# EAGLE design DAU_Kupplung_1_phasig_V1_13 (EAGLE 6.1)
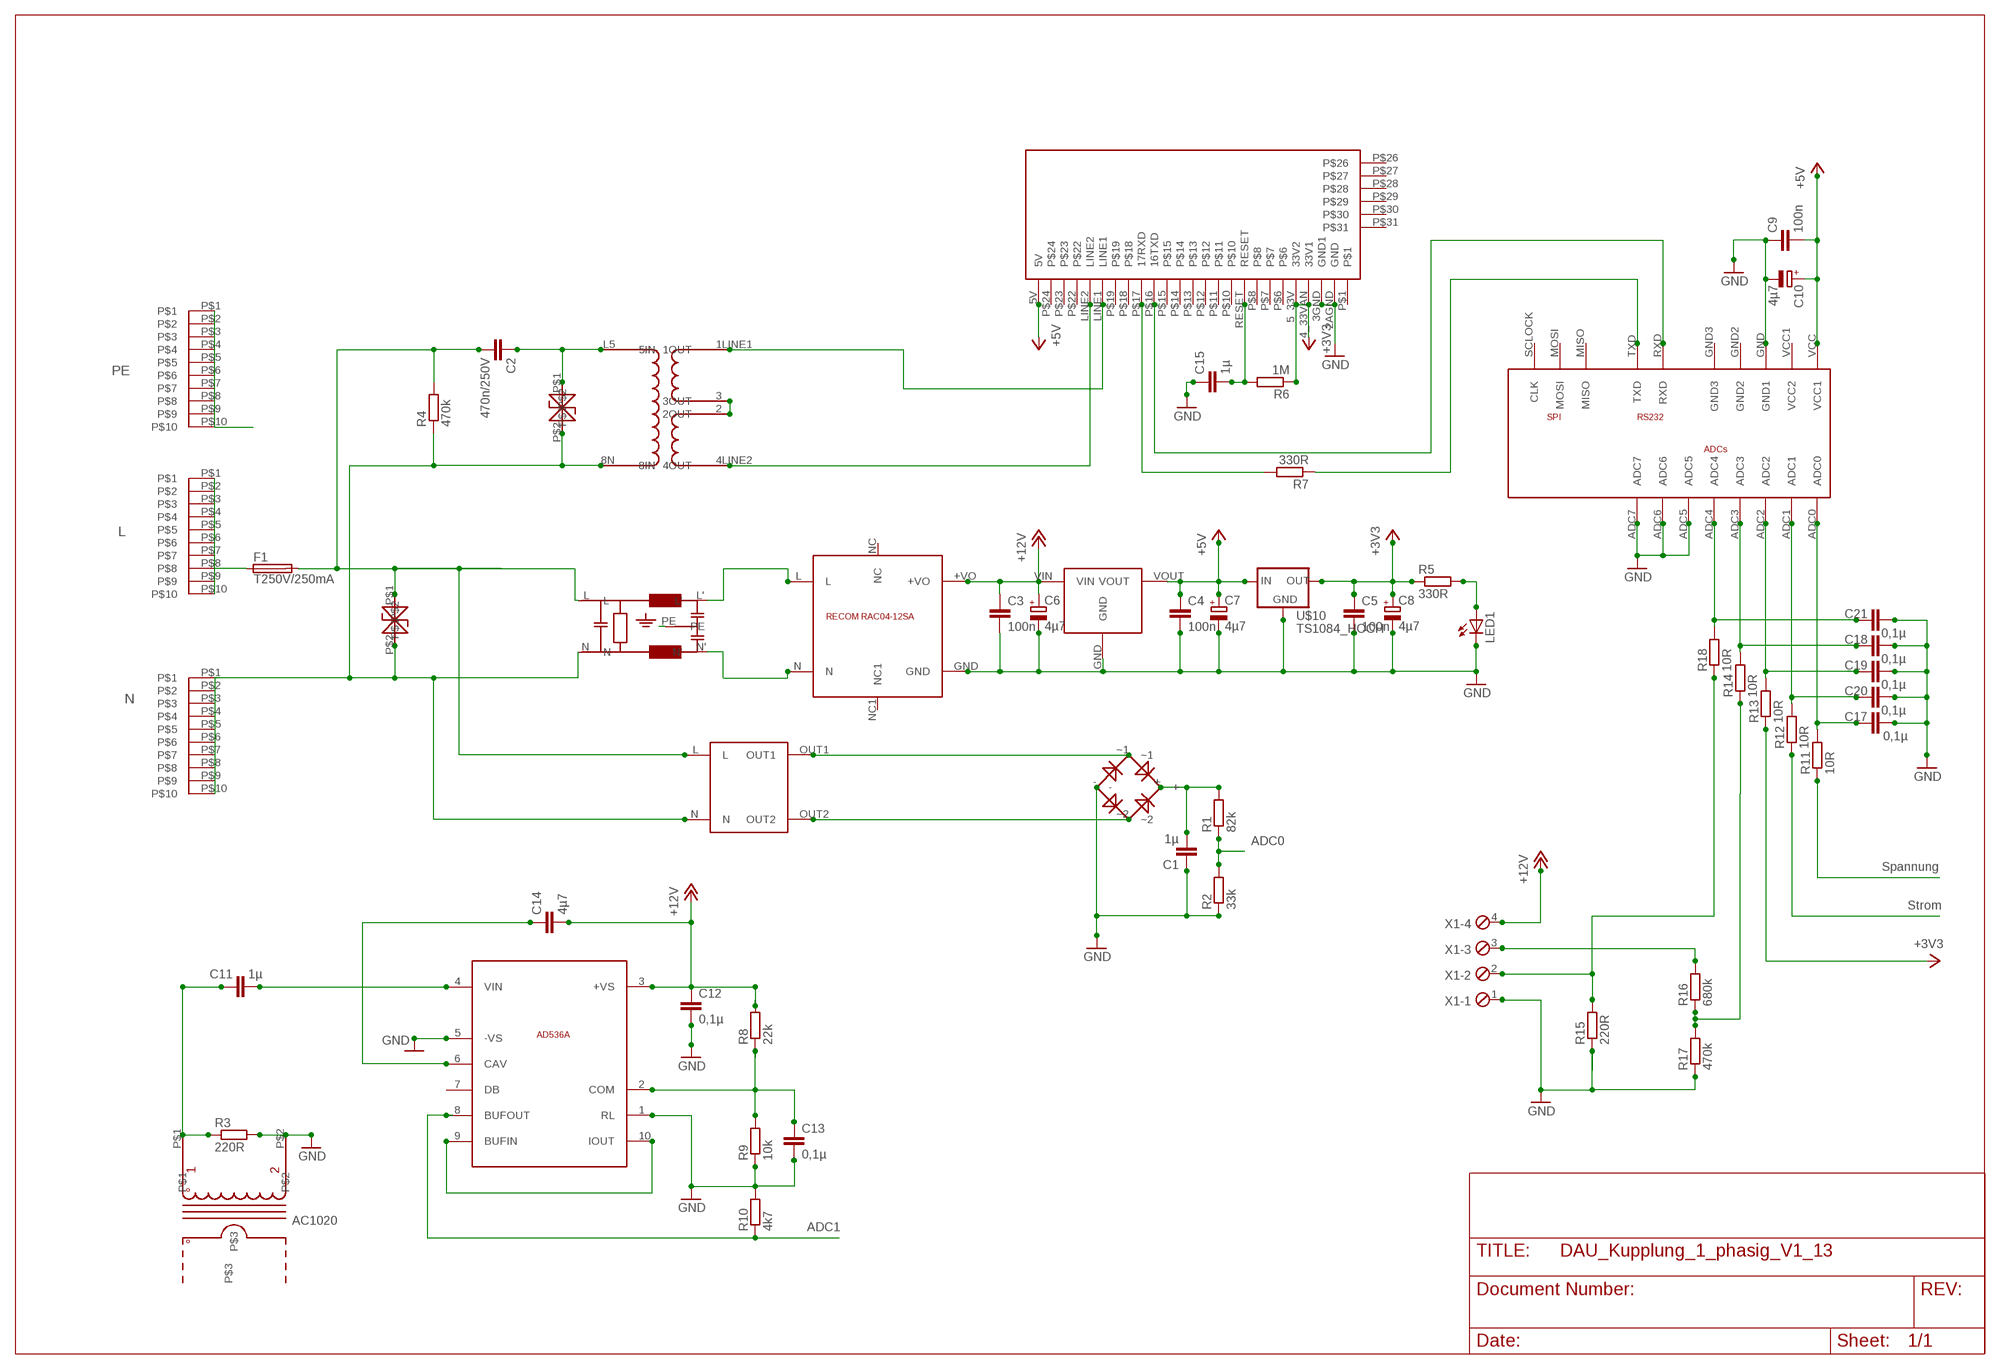
[diagram p0: schematic, sheet 1]

## Parts
AC1020  AC1010  [AC1010]
C1  1µ  C2,5-3  [C2.5-3]
C2  470n/250V  C-EU150-072X183  [C150-072X183]
C3  100n  C-EUC0805  [C0805]
C4  100n  C-EUC0805  [C0805]
C5  100n  C-EUC0805  [C0805]
C6  4µ7  CPOL-EUE2-4  [E2-4]
C7  4µ7  CPOL-EUE2-4  [E2-4]
C8  4µ7  CPOL-EUE2-4  [E2-4]
C9  100n  C-EUC0805  [C0805]
C10  4µ7  CPOL-EUE2-4  [E2-4]
C11  1µ  C-EUC0805  [C0805]
C12  0,1µ  C-EUC0805  [C0805]
C13  0,1µ  C-EUC0805  [C0805]
C14  4µ7  C-EUC0805  [C0805]
C15  1µ  C-EUC0805  [C0805]
C17  0,1µ  C-EUC0805  [C0805]
C18  0,1µ  C-EUC0805  [C0805]
C19  0,1µ  C-EUC0805  [C0805]
C20  0,1µ  C-EUC0805  [C0805]
C21  0,1µ  C-EUC0805  [C0805]
F1  T250V/250mA  TR5  [TR5]
L  PRINT_CONNECTOR  [FASTON_DOUBLE]
LED1  LEDSQR2X5  [LED2X5]
N  PRINT_CONNECTOR  [FASTON_DOUBLE]
PE  PRINT_CONNECTOR  [FASTON_DOUBLE]
R1  82k  R-EU_R1206  [R1206]
R2  33k  R-EU_R1206  [R1206]
R3  220R  R-EU_R1206  [R1206]
R4  470k  R-EU_0204/7  [0204/7]
R5  330R  R-EU_R1206  [R1206]
R6  1M  R-EU_R1206  [R1206]
R7  330R  R-EU_R1206  [R1206]
R8  22k  R-EU_R1206  [R1206]
R9  10k  R-EU_R1206  [R1206]
R10  4k7  R-EU_R1206  [R1206]
R11  10R  R-EU_R1206  [R1206]
R12  10R  R-EU_R1206  [R1206]
R13  10R  R-EU_R1206  [R1206]
R14  10R  R-EU_R1206  [R1206]
R15  220R  R-EU_R1206  [R1206]
R16  680k  R-EU_R1206  [R1206]
R17  470k  R-EU_R1206  [R1206]
R18  10R  R-EU_R1206  [R1206]
U$1  RECOM_RAC04_12SA  [RAC04_12SA]
U$2  SICHERHEITSTRAFO  [TRAFO_0,35VA]
U$3  ADUC831_MINIMUM  [ADUC_MINIMUM]
U$4  IT800  [IT800]
U$5  PLC_UEBERTRAGER_V2  [PLC-UEBERTRAGER_V2]
U$6  NETZFILTER_05_A  [NETZFILTER]
U$7  AD536  [TO100_10PIN]
U$8  RECTIFIER  [RECTIFIER]
U$9  TSV  [TSV]
U$10  TS1084_HOCH  [TS1084_HOCH]
U$11  RECOM_785_05  [RECOM785X]
U$12  TSV  [TSV]
X1  MPT4  [4POL254]

## Nets
+3V3: C5.1 C8.+ R5.1 R6.1 R13.1 U$4.4_33VAN(33V1) U$4.5_33V(33V2) U$10.OUT
+5V: C4.1 C7.+ C9.2 C10.+ U$3.VCC(VCC1) U$4.5V U$10.IN U$11.VOUT
+12V: C3.1 C6.+ C12.1 C14.2 R8.2 U$1.+VO U$7.3(+VS) U$11.VIN X1.4
ADC0: R1.1 R2.2 R11.1
ADC1: R10.1 R12.1 U$7.8(BUFOUT)
GND: AC1020.P$2 C1.1 C3.2 C4.2 C5.2 C6.- C7.- C8.- C9.1 C10.- C12.2 C13.2 C15.1 C17.2 C18.2 C19.2 C20.2 C21.2 LED1.K(C) R2.1 R3.2 R9.1 R10.2 R15.1 R17.1 U$1.GND U$3.ADC5 U$3.ADC6 U$3.ADC7 U$3.GND(GND1) U$4.2AGND(GND) U$4.3GND(GND1) U$7.1(RL) U$7.5(-VS) U$8.- U$10.GND U$11.GND X1.1
N$1: U$5.2(2OUT) U$5.3(3OUT)
N$2: U$7.9(BUFIN) U$7.10(IOUT)
N$3: R7.2 U$4.P$17(17RXD)
N$4: U$2.OUT1 U$8.~1
N$5: U$4.LINE1 U$5.1LINE1(1OUT)
N$6: F1.1 L.P$1 L.P$2 L.P$3 L.P$4 L.P$5 L.P$6 L.P$7 L.P$8 L.P$9 L.P$10
N$7: C1.2 R1.2 U$8.+
N$8: AC1020.P$1 C11.1 R3.1
N$9: U$2.OUT2 U$8.~2
N$10: C11.2 U$7.4(VIN)
N$11: C2.1 U$5.L5(5IN) U$12.P$1
N$13: U$4.LINE2 U$5.4LINE2(4OUT)
N$14: R7.1 U$3.TXD
N$15: U$3.RXD U$4.P$16(16TXD)
N$16: C14.1 U$7.6(CAV)
N$17: C21.1 R18.2 U$3.ADC4
N$18: U$1.L U$6.L'
N$19: LED1.A R5.2
N$20: C15.2 R6.2 U$4.RESET
N$21: C13.1 R8.1 R9.2 U$7.2(COM)
N$22: U$1.N U$6.N'
N$23: N.P$1 N.P$2 N.P$3 N.P$4 N.P$5 N.P$6 N.P$7 N.P$8 N.P$9 N.P$10 R4.1 U$2.N U$5.8N(8IN) U$6.N U$9.P$2 U$12.P$2
N$24: C2.2 F1.2 R4.2 U$2.L U$6.L U$9.P$1
N$27: C18.1 R14.2 U$3.ADC3
N$28: C19.1 R13.2 U$3.ADC2
N$29: C20.1 R12.2 U$3.ADC1
N$30: C17.1 R11.2 U$3.ADC0
N$31: R15.2 R18.1 X1.2
N$32: R16.2 X1.3
N$33: R14.1 R16.1 R17.2
PE: PE.P$1 PE.P$2 PE.P$3 PE.P$4 PE.P$5 PE.P$6 PE.P$7 PE.P$8 PE.P$9 PE.P$10 U$6.PE
Unconnected: AC1020.P$3 U$1.NC U$1.NC1 U$3.GND2 U$3.GND3 U$3.MISO U$3.MOSI U$3.SCLOCK(CLK) U$3.VCC1(VCC2) U$4.P$1 U$4.P$6 U$4.P$7 U$4.P$8 U$4.P$10 U$4.P$11 U$4.P$12 U$4.P$13 U$4.P$14 U$4.P$15 U$4.P$18 U$4.P$19 U$4.P$22 U$4.P$23 U$4.P$24 U$4.P$26 U$4.P$27 U$4.P$28 U$4.P$29 U$4.P$30 U$4.P$31 U$7.7(DB)

## Notes on the sheet
- PE
- L
- N
- ADC0
- Spannung
- Strom
- AC1020
- ADC1

## Library data of the parts
AC1020 = ADS:AC1010
C1 = capacitor-wima:C: CAPACITOR naming: grid - package width
C2-C5 C15 C17-C21 = resistor:C-EU: CAPACITOR, European symbol
C6-C8 C10 = rcl:CPOL-EU: POLARIZED CAPACITOR, European symbol
C9 C11-C14 = rcl:C-EU: CAPACITOR, European symbol
F1 = fuse:TR5: FUSE Wickmann; OC_FARNELL: unknown; OC_NEWARK: unknown
L N PE = ADS:PRINT_CONNECTOR
LED1 = led:LED: LED OSRAM: - CHIPLED LG R971, LG N971, LY N971, LG Q971, LY Q971, LO R971, LY R971 LH N974, LH R974 LS Q976, LO Q976, LY Q976 LO Q996 - Hyper CHIPLED LW Q18S LB Q993, LB Q99A, LB R99A - SideLED LS A670, LO A670, LY A670, LG A670, LP A670 LB A673, LV A673, LT A673, LW A673 LH A674 LY A675 LS A676, LA A676, LO A676, LY A676, LW A676 LS A679, LY A679, LG A679 - Hyper Micro SIDELED® LS Y876, LA Y876, LO Y876, LY Y876 LT Y87S - SmartLED LW L88C, LW L88S LB L89C, LB L89S, LG L890 LS L89K, LO L89K, LY L89K LS L896, LA L896, LO L896, LY L896 - TOPLED LS T670, LO T670, LY T670, LG T670, LP T670 LSG T670, LSP T670, LSY T670, LOP T670, LYG T670 LG T671, LOG T671, LSG T671 LB T673, LV T673, LT T673, LW T673 LH T674 LS T676, LA T676, LO T676, LY T676, LB T676, LH T676, LSB T676, LW T676 LB T67C, LV T67C, LT T67C, LS T67K, LO T67K, LY T67K, LW E67C LS E67B, LA E67B, LO E67B, LY E67B, LB E67C, LV E67C, LT E67C LW T67C LS T679, LY T679, LG T679 LS T770, LO T770, LY T770, LG T770, LP T770 LB T773, LV T773, LT T773, LW T773 LH T774 LS E675, LA E675, LY E675, LS T675 LS T776, LA T776, LO T776, LY T776, LB T776 LHGB T686 LT T68C, LB T68C - Hyper Mini TOPLED® LB M676 - Mini TOPLED Santana® LG M470 LS M47K, LO M47K, LY M47K Source: http://www.osram.convergy.de LUXEON: - LUMILED® LXK2-PW12-R00, LXK2-PW12-S00, LXK2-PW14-U00, LXK2-PW14-V00 LXK2-PM12-R00, LXK2-PM12-S00, LXK2-PM14-U00 LXK2-PE12-Q00, LXK2-PE12-R00, LXK2-PE12-S00, LXK2-PE14-T00, LXK2-PE14-U00 LXK2-PB12-K00, LXK2-PB12-L00, LXK2-PB12-M00, LXK2-PB14-N00, LXK2-PB14-P00, LXK2-PB14-Q00 LXK2-PR12-L00, LXK2-PR12-M00, LXK2-PR14-Q00, LXK2-PR14-R00 LXK2-PD12-Q00, LXK2-PD12-R00, LXK2-PD12-S00 LXK2-PH12-R00, LXK2-PH12-S00 LXK2-PL12-P00, LXK2-PL12-Q00, LXK2-PL12-R00 Source: www.luxeon.com KINGBRIGHT: KA-3528ASYC Source: www.kingbright.com
R1-R18 = resistor:R-EU_: RESISTOR, European symbol
U$1 = ADS:RECOM_RAC04_12SA
U$2 = ADS:SICHERHEITSTRAFO
U$3 = ADS_ADUCBoards:ADUC831_MINIMUM
U$4 = ADS:IT800
U$5 = ADS1:PLC_UEBERTRAGER_V2
U$6 = ADS:NETZFILTER_05_A
U$7 = ADS:AD536
U$8 = ADS:RECTIFIER
U$9 U$12 = ADS:TSV
U$10 = ADS:TS1084_HOCH
U$11 = ADS:RECOM_785_05
X1 = con-phoenix-254:MPT4: PHOENIX CONNECTOR; OC_FARNELL: unknown; OC_NEWARK: unknown

## Board
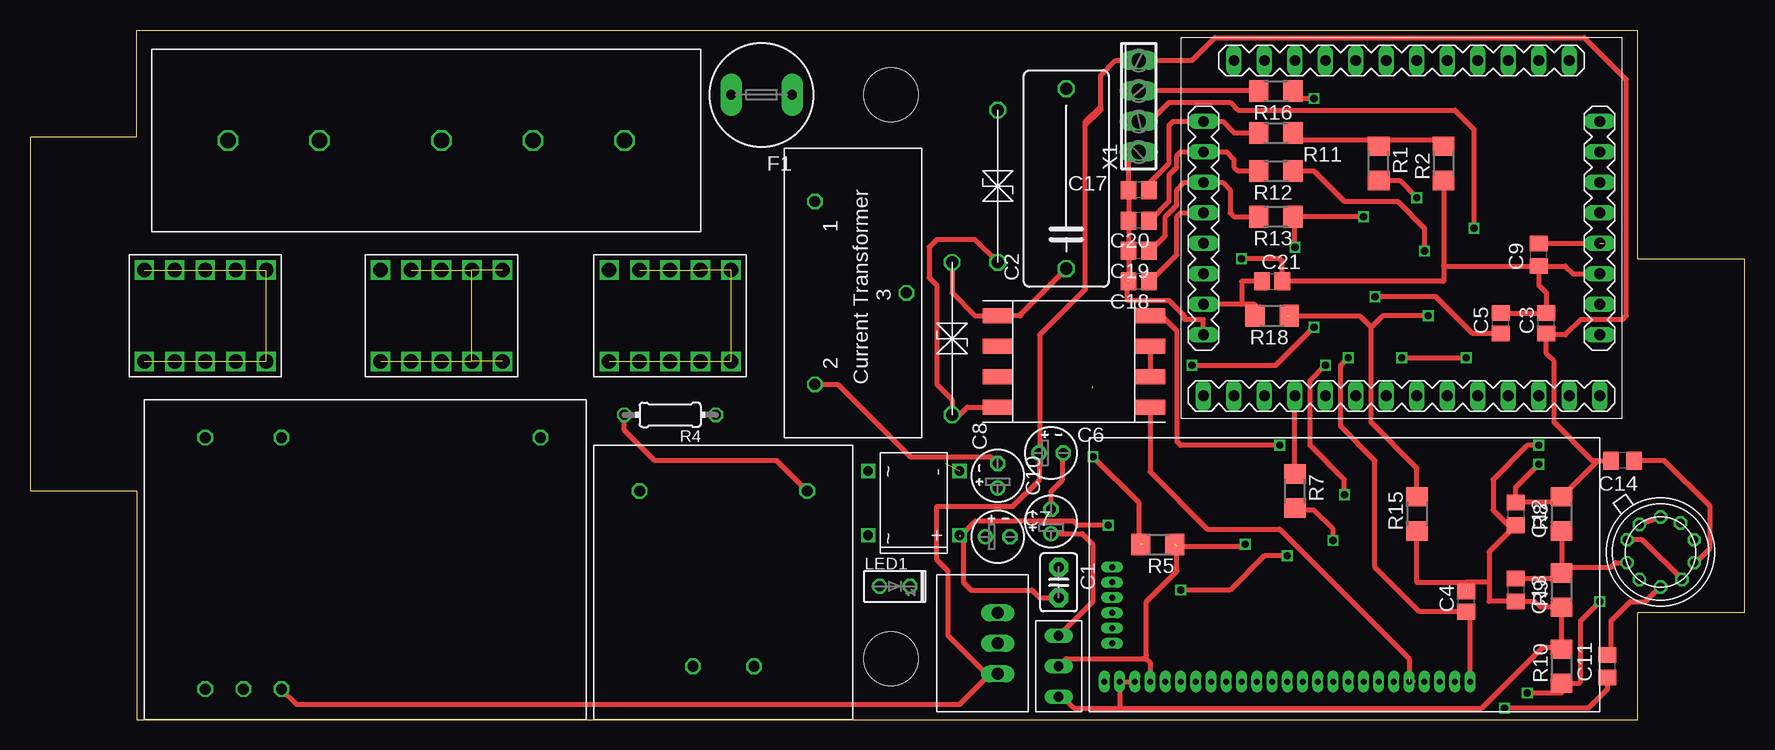
[diagram p1: board, top side]
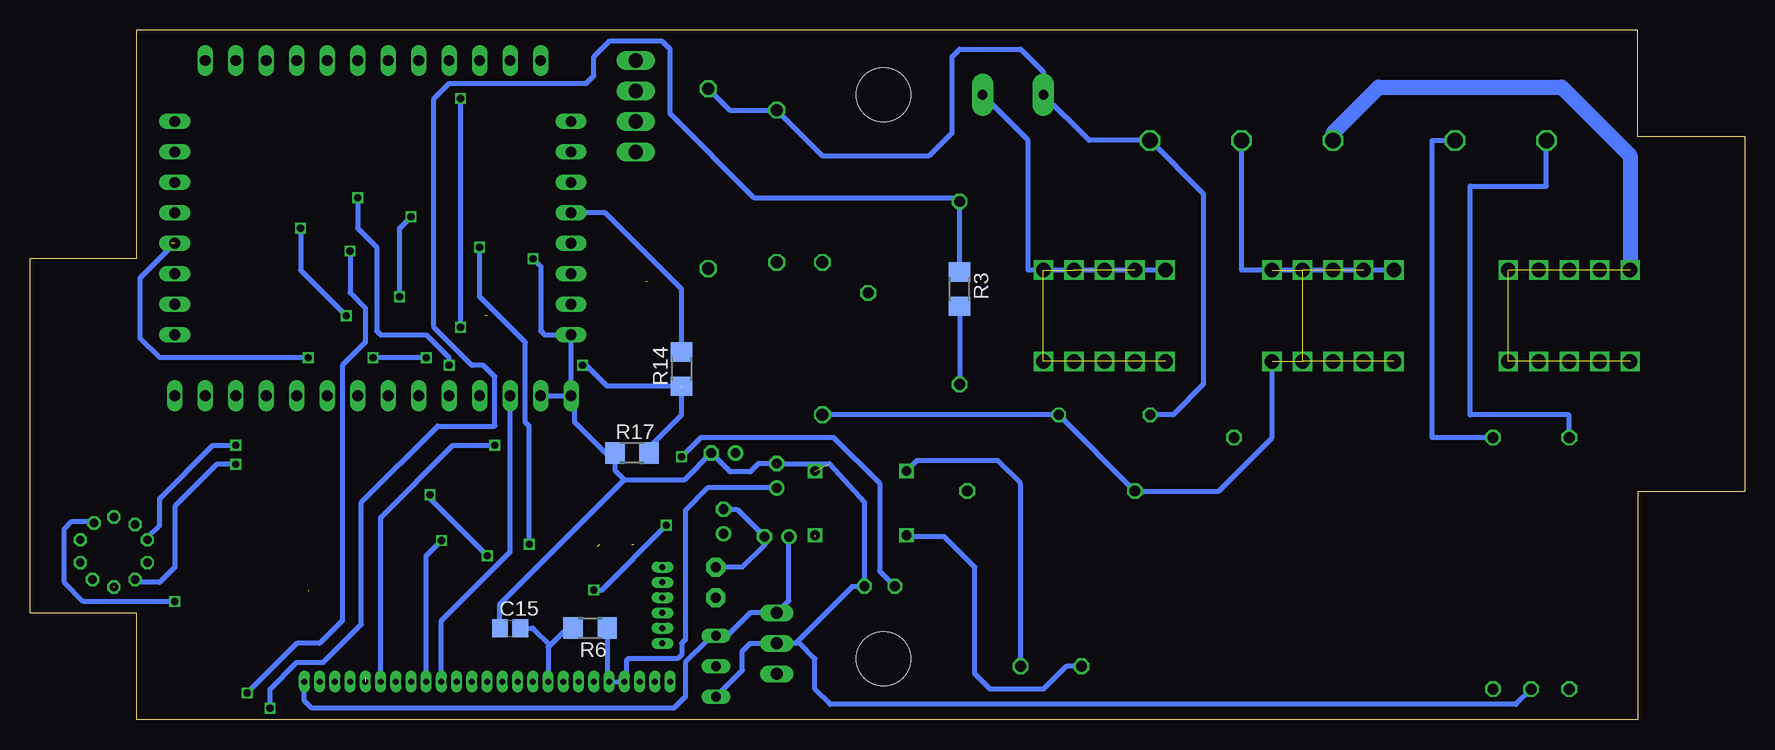
[diagram p2: board, bottom side, seen from below]

Size 142.88 x 57.47 mm. Coordinates in mm from the lower left corner, seen from the top.
Outline: 8.89,0 133.99,0 133.99,8.89 142.88,8.89 142.88,38.42 133.99,38.42 133.99,57.47 8.89,57.47 8.89,48.58 0,48.58 0,19.05 8.89,19.05 8.89,0
Copper layers (1+2*15+16): Top 0.035mm / dielectric 0.38mm / Route2 0.035mm / dielectric 0.71mm / Route15 0.035mm / dielectric 0.38mm / Bottom 0.035mm
Design rules: minimum track width 0.15mm, minimum drill 0.3mm, track to track 0.15mm, track to pad 0.15mm, pad to pad 0.15mm, via to via 0.15mm, smd to smd 0.15mm, copper to edge 0.3mm, drill to drill 0.2mm, minimum pad ring 0.2mm, minimum via ring 0.15mm, stop-mask expansion 0.075mm, vias tented up to drill 0mil, thermal gap 0.2mm
Holes 4.5 mm at 71.75,52.07 71.75,5.08

### Footprints (pad centres in the part's own frame; a part is rotated, then mirrored left to right if it is on the bottom)
AC1010 = drill 0.9 octagon: P$1 20.32,8.89; P$2 5.08,8.89; P$3 12.7,1.27
C2.5-3 = drill 0.813 pad 1.6 octagon: 1 -1.27,0; 2 1.27,0
C150-072X183 = drill 1.016 octagon: 1 -7.493,0; 2 7.493,0
C0805 = smd 1.3 x 1.5: 1 -0.85,0; 2 0.85,0
E2-4 = drill 0.813 pad 1.27: + -1.016,0 | drill 0.813 pad 1.27 octagon: - 1.016,0
C0805' = smd 1.3 x 1.5: 1 -0.95,0; 2 0.95,0
TR5 = drill 0.813 pad 1.778 long: 1 -2.54,0; 2 2.54,0
FASTON_DOUBLE = drill 1.2 square: P$1 -5.08,-3.81; P$2 -2.54,-3.81; P$3 -5.08,3.81; P$4 -2.54,3.81; P$5 0,3.81; P$6 2.54,3.81; P$7 5.08,3.81; P$8 0,-3.81; P$9 2.54,-3.81; P$10 5.08,-3.81
LED2X5 = drill 0.813 octagon: A -1.27,0; K 1.27,0
R1206 = smd 1.6 x 1.803: 1 -1.422,0; 2 1.422,0
0204/7 = drill 0.813 octagon: 1 -3.81,0; 2 3.81,0
RAC04_12SA = drill 0.9 octagon: +VO 25.4,24.13; GND 28.575,24.13; L 31.75,3.175; N 25.4,3.175; NC 3.81,3.175; NC1 31.75,24.13
TRAFO_0,35VA = drill 0.9 octagon: L 3.81,17.78; N 3.81,3.81; OUT1 18.415,13.335; OUT2 18.415,8.255
ADUC_MINIMUM = drill 0.9 long: ADC0 -9.207,-16.51; ADC1 -6.668,-16.51; ADC2 -4.128,-16.51; ADC3 -1.587,-16.51; ADC4 6.032,-16.51; ADC5 8.572,-16.51; ADC6 13.652,-16.51; ADC7 13.652,-13.97; ALE -14.287,6.35; DAC0 0.953,-16.51; DAC1 3.493,-16.51; GND 3.493,16.51; GND2 -4.128,16.51; GND3 -6.668,16.51; INT0 13.652,-6.35; MISO 13.652,-3.81; MOSI 13.652,11.43; P00 -14.287,3.81; P01 -14.287,1.27; P02 -14.287,-1.27; P03 -14.287,-3.81; P04 -14.287,-6.35; P05 -14.287,-8.89; P06 -14.287,-11.43; P07 -14.287,-13.97; P20 13.652,13.97; P21 13.652,16.51; P22 8.572,16.51; P23 6.032,16.51; P24 -9.207,16.51; P25 -14.287,13.97; P34 13.652,-1.27; P35 13.652,1.27; P36 13.652,3.81; P37 13.652,6.35; PWM0 -14.287,11.43; PWM1 -14.287,8.89; RXD 13.652,-11.43; SCLOCK 13.652,8.89; TXD 13.652,-8.89; VCC 0.953,16.51; VCC1 -1.587,16.51
IT800 = drill 0.5 long: 2AGND 2.54,2.54; 3GND 3.81,2.54; 4_33VAN 5.08,2.54; 5_33V 6.35,2.54; 5V 31.75,2.54; LINE1 25.4,2.54; LINE2 26.67,2.54; P$1 1.27,2.54; P$6 7.62,2.54; P$7 8.89,2.54; P$8 10.16,2.54; P$10 12.7,2.54; P$11 13.97,2.54; P$12 15.24,2.54; P$13 16.51,2.54; P$14 17.78,2.54; P$15 19.05,2.54; P$16 20.32,2.54; P$17 21.59,2.54; P$18 22.86,2.54; P$19 24.13,2.54; P$22 27.94,2.54; P$23 29.21,2.54; P$24 30.48,2.54; P$26 1.905,5.715; P$27 1.905,6.985; P$28 1.905,8.255; P$29 1.905,9.525; P$30 1.905,10.795; P$31 1.905,12.065; RESET 11.43,2.54
PLC-UEBERTRAGER_V2 = smd 2.54 x 1.27: 1LINE1 6.35,3.81; 2 6.35,1.27; 3 6.35,-1.27; 4LINE2 6.35,-3.81; 6NC -6.35,1.27; 7NC -6.35,-1.27; 8N -6.35,-3.81; L5 -6.35,3.81
NETZFILTER = drill 1.3 octagon: L 6.35,7.62; L' 39.37,7.62; N 13.97,7.62; N' 31.75,7.62; PE 21.59,7.62
TO100_10PIN = drill 0.7 octagon: 1 2.794,-1.016; 2 2.794,0.889; 3 1.778,2.286; 4 0,2.921; 5 -1.778,2.286; 6 -2.794,0.889; 7 -2.794,-1.016; 8 -1.651,-2.413; 9 0,-2.921; 10 1.778,-2.286
RECTIFIER = drill 0.8 square: + 6.858,7.62; - 1.524,7.62; ~1 1.524,0; ~2 6.858,0
TSV = drill 1 octagon: P$1 -5.08,0; P$2 7.62,0
TS1084_HOCH = drill 0.8 long: GND 0,0; IN 5.08,0; OUT 2.54,0
RECOM785X = drill 1 long: GND 0,2.54; VIN -2.54,2.54; VOUT 2.54,2.54
4POL254 = drill 1.2 long: 1 -3.81,0; 2 -1.27,0; 3 1.27,0; 4 3.81,0

### Placement (x,y rotation side)
AC1020  74.3,22.86 90 top
C1  85.72,11.43 270 top
C2  86.36,45.09 90 top
C3  126.36,33.02 90 top
C4  119.7,9.84 90 top
C5  122.56,33.02 90 top
C6  85.09,22.23 0 top
C7  80.64,15.24 0 top
C8  80.64,20.32 90 top
C9  100n  [C0805']  125.73,38.73 90 top
C10  85.09,16.51 90 top
C11  1µ  [C0805']  131.44,4.45 90 top
C12  0,1µ  [C0805']  123.83,17.14 270 top
C13  0,1µ  [C0805']  123.83,10.79 270 top
C14  4µ7  [C0805']  132.72,21.59 180 top
C15  102.87,7.62 0 bottom
C17  92.39,44.13 180 top
C18  92.39,36.51 180 top
C19  92.39,39.05 180 top
C20  92.39,41.59 180 top
C21  103.5,36.51 0 top
F1  60.96,52.07 180 top
L  53.34,33.66 0 top
LED1  72.07,11.11 0 top
N  34.29,33.66 0 top
PE  14.61,33.66 0 top
R1  112.39,46.35 270 top
R2  117.79,46.35 90 top
R3  65.41,35.88 270 bottom
R4  53.34,25.4 180 top
R5  93.98,14.61 180 top
R6  96.2,7.62 180 bottom
R7  105.41,19.05 270 top
R8  127.64,17.14 90 top
R9  127.64,10.79 90 top
R10  127.64,4.45 90 top
R11  103.82,48.9 180 top
R12  103.82,45.72 180 top
R13  103.82,41.91 180 top
R14  88.58,29.21 90 bottom
R15  115.57,17.14 90 top
R16  103.82,52.39 180 top
R17  92.71,22.23 0 bottom
R18  103.5,33.66 180 top
U$1  46.35,26.67 180 top
U$2  46.99,22.86 270 top
U$3  114.3,40.64 270 top
U$4  88.27,0.64 0 top
U$5  87,29.84 0 top
U$6  55.88,55.88 180 top
U$7  135.89,13.97 180 top
U$8  69.85,22.23 270 top
U$9  80.64,45.72 270 top
U$10  85.72,1.91 90 top
U$11  83.19,6.35 90 top
U$12  76.83,33.02 270 top
X1  92.39,51.12 90 top

### Tracks (layer width: path | path; a pad name or v marks a point on that pad's centre or on a via)
+3V3  (via drill 0.6)  (1 unrouted)
  Top 0.406: 92.71,5.08 86.36,5.08 U$10.OUT | 92.71,5.08 arc90 93.03,5.4 93.03,9.84 95.57,12.38 95.57,14.44 101.12,14.44 v101.28,14.61 | 92.71,5.08 93.03,5.08 93.34,4.76 U$4.4_33VAN | C5.1 120.23,32.17 117.16,35.24 v112.08,35.24 | v111.12,41.91 105.73,41.91 | 105.73,41.91 R13.1 | v105.41,39.37 105.41,41.59 105.73,41.91
  Bottom 0.406: R6.1 94.78,3.34 U$4.5_33V U$4.4_33VAN 93.19,3.33 93.19,4.92 93.03,5.08 88.9,5.08 88.58,5.4 88.58,6.35 88.27,6.67 88.27,17.46 86.42,19.3 C8.+ | v112.08,35.24 112.08,40.96 v111.12,41.91 | v101.28,14.61 101.28,24.45 101.6,24.77 101.6,31.43 105.41,35.24 v105.41,39.37
+5V  (via drill 0.6)  (1 unrouted)
  Top 0.406: C9.2 131.12,39.69 131.13,39.69 | U$4.5V 120.02,8.68 C4.1 115.78,8.99 112.08,12.7 112.08,21.59 109.22,24.45 109.22,29.53 v109.86,30.16 | v114.3,30.16 v119.7,30.16 | C10.+ 87.69,15.49 88.58,14.61 88.58,9.84 U$10.IN
  Bottom 0.406: C7.+ 79.63,9.91 U$11.VOUT 82.87,8.89 84.77,6.99 U$10.IN 86.36,6.99 86.36,6.67 88.27,4.76 88.27,1.91 89.22,0.95 119.38,0.95 120.02,1.59 U$4.5V | v109.86,30.16 v114.3,30.16 | v119.7,30.16 132.08,30.16 133.67,31.75 133.67,36.83 U$3.VCC
+12V  (via drill 0.6)
  Top 0.406: 130.66,21.59 R8.2 127.16,18.09 C12.1 123.83,19.37 v125.73,21.27 | 130.66,21.59 C14.2 | 130.66,21.59 130.18,21.59 127,24.77 127,29.84 126.36,30.48 C3.1 126.47,32.07 127.95,32.07 129.22,33.34 132.72,33.34 133.03,33.66 133.03,53.34 129.54,56.83 98.74,56.83 96.84,54.93 X1.4 90.49,54.93 89.22,53.66 89.22,51.12 | 89.22,51.12 89.22,50.8 87.95,49.53 | 87.95,49.53 87.95,35.88 84.14,32.07 84.14,22.29 C6.+ 84.14,22.16 84.14,20 81.92,17.78 75.56,17.78 75.56,13.34 76.52,12.38 76.52,6.99 79.69,3.81 U$11.VIN 80.01,3.81 77.47,1.27 22.23,1.27 U$1.+VO | 87.95,49.53 87.95,49.85 89.22,51.12
  Bottom 0.406: v125.73,21.27 127.32,21.27 130.81,17.78 130.81,12.7 132.08,11.43 133.86,11.43 U$7.3
ADC0
  Top 0.406: 105.73,48.41 R11.1 105.09,48.74 105.09,48.26 105.73,48.26 112.39,48.26 | R1.1 112.39,48.26 | R2.2 117.79,48.26 112.39,48.26
ADC1  (via drill 0.6)
  Top 0.406: R12.1 107,45.72 109.54,43.18 113.98,43.18 116.2,40.96 v116.2,39.05 | v124.78,2.22 127.64,2.22 R10.1 129.07,3.02 129.22,3.17 129.22,8.26 v130.81,9.84
  Bottom 0.406: v116.2,39.05 116.2,35.56 114.94,34.29 114.94,31.43 116.84,29.53 116.84,8.26 118.75,6.35 120.65,6.35 v124.78,2.22 | v130.81,9.84 138.43,9.84 140.02,11.43 140.02,15.88 139.38,16.51 137.67,16.51 U$7.8
GND  (via drill 0.6)  (4 unrouted)
  Top 0.406: U$10.GND 86.04,1.91 87,0.95 90.81,0.95 | 127.17,5.4 R10.2 127.64,6.03 | 127.64,6.03 R9.1 125.88,9.37 125.41,9.84 C13.2 121.6,9.85 121.6,11.43 | R15.1 115.57,11.43 119.7,11.43 | X1.1 91.54,46.46 C17.2 C20.2 C19.2 C18.2 | C9.1 127.95,37.78 128.59,37.15 U$3.GND | C9.1 125.73,36.2 126.36,35.56 C3.2 C5.2 | R2.1 117.79,37.78 | 117.79,37.78 C9.1 | 117.79,37.78 117.79,36.51 C21.2 104.36,38.2 104.14,38.42 v100.97,38.42 | 121.6,11.43 121.6,13.97 C12.2 123.19,16.19 121.92,17.46 121.92,20 124.78,22.86 v125.73,22.86 | U$7.5 134.37,14.99 U$7.1 | U$4.3GND U$4.2AGND 90.81,0.95 | 121.6,11.43 119.7,11.43 | 119.7,11.43 119.7,10.79 | C10.- 85.09,19.05 86.04,20 86.04,22.16 C6.- | 90.81,0.95 120.97,0.95 126.05,6.03 127.64,6.03 | U$3.ADC5 97.79,33.34 96.2,33.34 96.2,33.66 94.93,34.92 91.44,34.92 91.44,36.51 | AC1020.P$2 67.31,27.94 73.34,21.91 80.01,21.91 80.64,21.27
  Bottom 0.406: U$1.GND 19.05,1.27 76.2,1.27 77.47,2.54 77.47,5.08 78.74,6.35 79.06,6.35 | 79.06,6.35 U$11.GND 82.87,6.35 83.5,5.71 83.5,4.13 U$10.GND | U$3.ADC7 U$3.ADC6 | U$3.ADC6 97.47,26.67 97.47,24.77 94.93,22.23 R17.1 94.13,20.79 93.34,20 | 93.34,20 88.33,20 C6.- 84.52,20.64 82.87,20.64 82.17,21.34 C8.- 76.26,21.34 73.34,18.1 LED1.K 74.3,11.11 79.06,6.35 | C15.1 103.72,9.63 93.34,20 | U$3.ADC6 U$3.ADC5 100.01,32.07 100.33,32.38 100.33,37.78 v100.97,38.42 | C10.- 83.95,17.53 C7.- 81.66,14.54 83.5,12.7 C1.1 | U$7.1 133.1,15.18 132.08,16.19 132.08,18.41 127.64,22.86 v125.73,22.86 | R3.2 AC1020.P$2
N$1
  Top 0.406: U$5.2 U$5.3
N$2
  Top 0.406: U$7.10 U$7.9
N$3  (via drill 0.6)
  Top 0.406: v108.58,14.92 108.58,15.88 107,17.46 105.58,17.46 R7.2
  Bottom 0.406: U$4.P$17 109.86,13.65 v108.58,14.92
N$4
  Bottom 0.406: U$2.OUT1 60.33,19.68 62.23,21.59 68.96,21.59 U$8.~1
N$5  (via drill 0.6)
  Top 0.406: U$5.1LINE1 94.3,33.66 95.57,32.38 95.57,23.18 95.89,22.86 v104.14,22.86
  Bottom 0.406: U$4.LINE1 113.67,16.83 107.63,22.86 v104.14,22.86
N$6  (8 unrouted)
  Bottom 0.406: L.P$3 L.P$7 59.69,37.47 59.69,48.26 F1.1
N$7  (via drill 0.6)  (1 unrouted)
  Top 0.406: U$8.+ 77.79,15.05 77.79,11.43 78.42,10.79 83.5,10.79 84.14,10.16 C1.2 | R1.2 114.14,44.93 v115.57,43.5 | v104.78,13.65 102.87,13.65 100.01,10.79 v95.89,10.79 | v89.85,16.19 87.31,16.19 87,16.51 78.74,16.51 77.47,15.24 | v109.54,18.73 109.54,20 106.68,22.86 106.68,28.26 v107.95,29.53
  Bottom 0.406: v115.57,43.5 115.57,40.96 113.98,39.37 113.98,32.38 113.67,32.07 109.86,32.07 107.95,30.16 v107.95,29.53 | v109.54,18.73 109.54,18.41 v104.78,13.65 | v95.89,10.79 95.25,10.79 v89.85,16.19
N$8  (via drill 0.6)
  Top 0.406: C11.1 131.44,2.54 129.86,0.95 v122.87,0.95
  Bottom 0.406: R3.1 AC1020.P$1 65.72,43.5 82.55,43.5 89.53,50.48 89.53,55.88 90.17,56.52 94.61,56.52 95.89,55.24 95.89,53.66 96.52,53.02 107.95,53.02 109.22,51.75 109.22,32.7 106.05,29.53 105.09,29.53 104.14,28.57 104.14,24.45 108.9,24.45 115.25,18.1 115.25,7.94 118.43,4.76 120.65,4.76 122.87,2.54 v122.87,0.95
N$9
  Bottom 0.406: U$2.OUT2 56.52,4.45 58.42,2.54 62.87,2.54 64.14,3.81 64.14,12.7 66.67,15.24 69.72,15.24 U$8.~2
N$10  (1 unrouted)
  Top 0.406: C11.2 131.76,5.71 131.76,8.26 133.35,9.84 134.62,9.84 135.89,11.11
N$11
  Top 0.406: U$12.P$1 76.83,35.56 78.74,33.66 U$5.L5 82.55,33.66 82.55,33.78 C2.1
N$13  (1 unrouted)
  Top 0.406: U$5.4LINE2 93.34,20.64 98.11,15.88 104.14,15.88 114.94,5.08 114.94,3.49 115.25,3.17
N$14
  Top 0.406: R7.1 U$3.TXD
N$15
  Bottom 0.406: U$4.P$16 108.58,8.26 102.87,13.97 U$3.RXD
N$16
  Top 0.406: U$7.6 138.94,13.34 139.06,13.34 140.02,14.29 140.02,17.78 136.21,21.59 C14.1
N$17
  Top 0.406: R18.2 102.08,34.61 100.97,34.61 | 100.97,34.61 U$3.ADC4 | C21.1 100.97,36.51 100.97,34.61
N$18
  Bottom 0.406: U$1.L 14.61,25.4 22.86,25.4 22.86,44.45 16.51,44.45 U$6.L'
N$19  (via drill 0.6)  (1 unrouted)
  Top 0.406: v88.58,21.91 92.39,18.1 92.39,14.92 92.71,14.61
  Bottom 0.406: v88.58,21.91 87,23.5 75.88,23.5 72.07,19.68 72.07,12.38 LED1.A
N$20
  Bottom 0.406: R6.2 98.11,7.62 99.54,6.19 | 99.54,6.19 99.69,6.03 U$4.RESET | C15.2 100.97,7.62 99.54,6.19
N$21
  Top 0.406: R8.1 R9.2 | R9.2 127.16,11.74 C13.1 | R9.2 128.12,12.7 131.76,12.7 132.14,13.08 U$7.2
N$22
  Bottom 0.406: U$1.N 26.04,23.5 26.04,48.26 U$6.N'
N$23  (8 unrouted)
  Top 0.406: U$5.8N 78.11,26.04 77.47,25.4 U$12.P$2 76.83,26.67 75.56,27.94 75.56,36.2 74.93,36.83 74.93,39.37 75.56,40.01 78.74,40.01 U$9.P$2
  Bottom 0.406: N.P$3 N.P$7 41.91,37.47 U$6.N | N.P$10 39.37,23.5 43.81,19.05 U$2.N R4.1 U$12.P$2
N$24
  Top 0.406: U$2.L 62.23,21.59 52.07,21.59 49.53,24.13 R4.2
  Bottom 0.406: C2.2 84.58,50.8 U$9.P$1 76.83,46.99 67.94,46.99 66.04,48.9 66.04,55.24 65.41,55.88 60.33,55.88 58.42,53.98 F1.2 54.61,48.26 U$6.L 45.09,43.81 45.09,27.94 47.62,25.4 R4.2
N$27
  Top 0.406: C18.1 93.34,36.51 95.57,38.73 95.57,41.91 95.89,42.23 U$3.ADC3
  Bottom 0.406: R14.2 88.58,35.88 94.93,42.23 U$3.ADC3
N$28
  Top 0.406: C19.1 93.34,39.05 94.61,40.32 94.61,41.91 95.57,42.86 95.57,44.13 96.2,44.77 U$3.ADC2 99.38,44.77 100.01,44.13 100.01,42.23 100.33,41.91 R13.2
N$29
  Top 0.406: C20.1 93.34,41.59 94.93,43.18 94.93,45.4 95.57,46.04 95.57,46.99 95.89,47.31 U$3.ADC1 99.69,47.31 100.33,46.67 100.33,46.04 100.65,45.72 R12.2
N$30
  Top 0.406: C17.1 93.24,44.66 94.93,46.35 94.93,49.53 95.25,49.85 U$3.ADC0 99.38,49.85 100.33,48.9 R11.2
N$31  (via drill 0.6)  (1 unrouted)
  Top 0.406: R15.2 115.57,20.95 111.76,24.77 111.76,32.7 | 104.78,33.66 110.81,33.66 111.76,32.7 | 111.76,32.7 112.71,33.66 v116.52,33.66 | X1.2 93.34,49.85 94.93,51.44 100.01,51.44 100.65,50.8 118.75,50.8 120.33,49.21 v120.33,40.96
  Bottom 0.406: v120.33,40.96 120.33,37.47 v116.52,33.66
N$32
  Top 0.406: R16.2 X1.3
N$33  (via drill 0.6)  (1 unrouted)
  Top 0.406: v96.84,29.53 103.82,29.53 v107,32.7 | v107,51.75 105.88,51.75 R16.1
  Bottom 0.406: R17.2 91.29,22.7 88.58,25.4 88.58,27.62 | R14.1 94.78,27.79 96.52,29.53 v96.84,29.53 | v107,32.7 v107,51.75
PE  (9 unrouted)
  Bottom 1.27: U$6.PE 34.29,48.9 30.48,52.7 15.24,52.7 9.53,46.99 PE.P$3